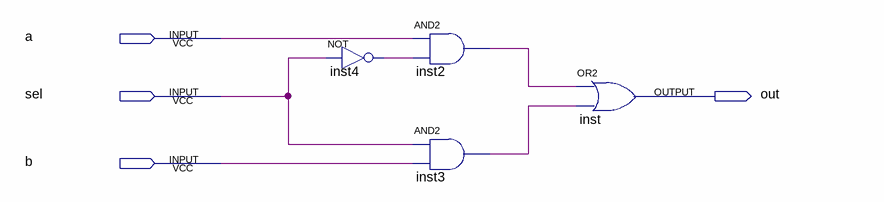
[diagram p0: schematic sheet]
// Quartus schematic Mux.bdf as structural Verilog: 4 symbols, 4 pins
module Mux (
  input  a,
  input  sel,
  input  b,
  output out
);

  wire inst2_out, inst3_out, inst4_out;

  not inst4 (inst4_out, sel);
  and inst2 (inst2_out, a, inst4_out);
  and inst3 (inst3_out, sel, b);
  or inst (out, inst2_out, inst3_out);
endmodule
